# Altium schematic sheet IF.SchDoc
size Letter; DrawnBy: Titan Yuan; SheetNumber: 5; SheetTotal: 9
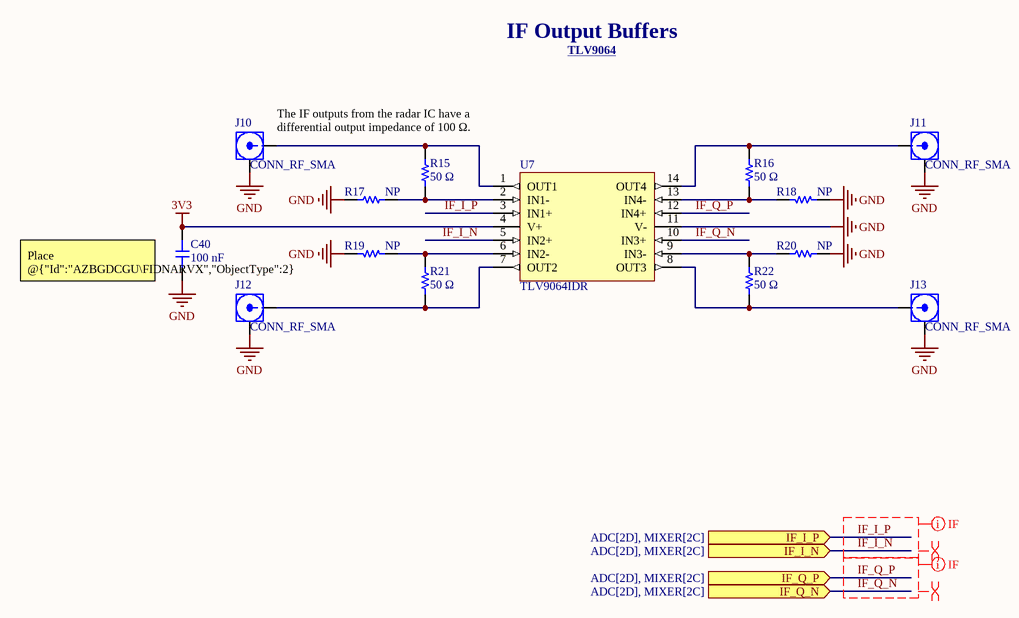
[diagram p0: IF.SchDoc]

## Parts
C40  100 nF  [CAP_0402]
J10  CONN_RF_SMA  [SMA-J-P-H-ST-TH1]
J11  CONN_RF_SMA  [SMA-J-P-H-ST-TH1]
J12  CONN_RF_SMA  [SMA-J-P-H-ST-TH1]
J13  CONN_RF_SMA  [SMA-J-P-H-ST-TH1]
R15  50 Ω  [RES_0603]
R16  50 Ω  [RES_0603]
R17  NP  [RES_0603]
R18  NP  [RES_0603]
R19  NP  [RES_0603]
R20  NP  [RES_0603]
R21  50 Ω  [RES_0603]
R22  50 Ω  [RES_0603]
U7  TLV9064IDR  [TLV9064IDR]

## Ports
IF_I_N (in, see ADC[2D], MIXER[2C]), IF_I_P (in, see ADC[2D], MIXER[2C]), IF_Q_N (in, see ADC[2D], MIXER[2C]), IF_Q_P (in, see ADC[2D], MIXER[2C])

## Nets
3V3: C40.2 U7.4(V+)
GND: C40.1 J10.2 J11.2 J12.2 J13.2 R17.2 R18.2 R19.2 R20.2 U7.11(V-)
IF_I_N: U7.5(IN2+) ; port IF_I_N
IF_I_P: U7.3(IN1+) ; port IF_I_P
IF_Q_N: U7.10(IN3+) ; port IF_Q_N
IF_Q_P: U7.12(IN4+) ; port IF_Q_P
NetJ10_1: J10.1 R15.2 U7.1(OUT1)
NetJ11_1: J11.1 R16.2 U7.14(OUT4)
NetJ12_1: J12.1 R21.2 U7.7(OUT2)
NetJ13_1: J13.1 R22.2 U7.8(OUT3)
NetR15_1: R15.1 R17.1 U7.2(IN1-)
NetR16_1: R16.1 R18.1 U7.13(IN4-)
NetR19_1: R19.1 R21.1 U7.6(IN2-)
NetR20_1: R20.1 R22.1 U7.9(IN3-)

## Layout directives
differential pair: IF_I_N, IF_I_P, IF_Q_N, IF_Q_P
mark named IF: IF_I_N, IF_I_P, IF_Q_N, IF_Q_P

## Notes on the sheet
- IF Output Buffers
- TLV9064 <https://www.ti.com/product/TLV9064>
- The IF outputs from the radar IC have a differential output impedance of 100 Ω.
- (near C40) Place @{"Id":"AZBGDCGU\FIDNARVX","ObjectType":2} as close to the device as possible.

## Library data of the parts
C40 = CAP: Ceramic Capacitor, Ceramic, 50V, 10% +Tol, 10% -Tol, X7R, 15% TC, 0.1uF, Surface Mount, 0402; Manufacturer: Yageo; Manufacturer Part Number: CC0402KPX7R9BB104; Tolerance: +-10%; Value: 100nF; Voltage Rating: 50 V; Dielectric: Ceramic; Package Size: 0402; Supplier: DigiKey; Supplier Part Number: 13-CC0402KPX7R9BB104CT-ND; RoHS: Compliant; Category: Ceramic Capacitors; Stock: 40680; Pricing: 1=0.1, 10=0.053, 50=0.0364, 100=0.0313, 500=0.02292, 1000=0.02035, 2500=0.01764, 5000=0.01601 (USD); Case/Package: 0402; China RoHS: Compliant; Dielectric Material: Ceramic; Height: 500µm; Lead Free: Lead Free; Length: 1mm; Lifecycle Status: Production; Max Operating Temperature: 125°C; Min Operating Temperature: -55°C; Mounting Technology: Surface Mount; Number of Terminals: 2; REACH SVHC: Yes; Voltage Rating (DC): 50V; Width: 500µm; ComponentLink1URL: https://datasheet.octopart.com:443/CC0402KPX7R9BB104-Yageo-datasheet-177165144.pdf?src-supplier=IHS; ComponentLink1Description: https://datasheet.octopart.com:443/CC0402KPX7R9BB104-Yageo-datasheet-177165144.pdf?src-supplier=IHS; ComponentLink2URL: https://datasheet.octopart.com:443/CC0402KPX7R9BB104-Yageo-Group-datasheet-189192896.pdf?src-supplier=Future+Electronics; ComponentLink2Description: https://datasheet.octopart.com:443/CC0402KPX7R9BB104-Yageo-Group-datasheet-189192896.pdf?src-supplier=Future+Electronics; ComponentLink3URL: https://datasheet.octopart.com:443/CC0402KPX7R9BB104-Yageo-datasheet-181967134.pdf?src-supplier=Farnell; ComponentLink3Description: https://datasheet.octopart.com:443/CC0402KPX7R9BB104-Yageo-datasheet-181967134.pdf?src-supplier=Farnell; ComponentLink4URL: https://datasheet.octopart.com/Surface-Mount-Ceramic-Multilayer-Capacitors%3B-General-Purpose-%26-High-Capacitance-Class-2%2C-X7R-Yageo-datasheet-family-114.pdf; ComponentLink4Description: https://datasheet.octopart.com/Surface-Mount-Ceramic-Multilayer-Capacitors%3B-General-Purpose-%26-High-Capacitance-Class-2%2C-X7R-Yageo-datasheet-family-114.pdf; ComponentLink5URL: https://datasheet.octopart.com/CC0402KPX7R9BB104-Yageo-datasheet-10883670.pdf; ComponentLink5Description: https://datasheet.octopart.com/CC0402KPX7R9BB104-Yageo-datasheet-10883670.pdf; ComponentLink6URL: http://sigma.octopart.com:80/rohs_statement/Surface-Mount-Ceramic-Multilayer-Capacitors%3B-General-Purpose-%26-High-Capacitance-Class-2%2C-X7R-Yageo-family-124.pdf?src-supplier=Compliance+Statements; ComponentLink6Description: http://sigma.octopart.com:80/rohs_statement/Surface-Mount-Ceramic-Multilayer-Capacitors%3B-General-Purpose-%26-High-Capacitance-Class-2%2C-X7R-Yageo-family-124.pdf?src-supplier=Compliance+Statements; ComponentLink7URL: http://sigma.octopart.com:80/reach_statement/Surface-Mount-Ceramic-Multilayer-Capacitors%3B-General-Purpose-%26-High-Capacitance-Class-2%2C-X7R-Yageo-family-125.pdf?src-supplier=Compliance+Statements; ComponentLink7Description: http://sigma.octopart.com:80/reach_statement/Surface-Mount-Ceramic-Multilayer-Capacitors%3B-General-Purpose-%26-High-Capacitance-Class-2%2C-X7R-Yageo-family-125.pdf?src-supplier=Compliance+Statements; ComponentLink8URL: http://sigma.octopart.com:80/conflict_mineral_statement/Yageo-company-3.pdf?src-supplier=Compliance+Statements; ComponentLink8Description: http://sigma.octopart.com:80/conflict_mineral_statement/Yageo-company-3.pdf?src-supplier=Compliance+Statements; ComponentLink9URL: http://sigma.octopart.com:80/rohs_statement/Yageo-company-2.pdf?src-supplier=Compliance+Statements; ComponentLink9Description: http://sigma.octopart.com:80/rohs_statement/Yageo-company-2.pdf?src-supplier=Compliance+Statements
J10-J13 = CONN_RF_SMA: RF / Coaxial Connector, SMA Coaxial, Straight Jack, Through Hole Vertical, 50 ohm; Manufacturer: Samtec; Manufacturer Lifecycle Status: PRODUCTION; Maximum Frequency: 20 GHz; Body Material: Brass; Body Plating: Gold; Connector Type: SMA, Socket; Dielectric Material: PTFE; Frequency: 20GHz; Gender: Female; Impedance: 50Ω; Clock Frequency: 6GHz; Number of Contacts: 1; Voltage Rating: 335V; Manufacturer Part Number: SMA-J-P-H-ST-TH1; Supplier: DigiKey; Supplier Part Number: SAM8971-ND; RoHS: Compliant; Category: RF / Coaxial Connectors; Stock: 25259; Pricing: 1=2.75, 10=2.333, 25=2.1864, 50=2.0818, 100=1.9823, 250=1.85816, 500=1.76948, 1000=1.68505, 2500=1.584 (USD); Case/Package: SMA; Contact Material: Gold; Contact Plating: Gold; Depth: 7mm; Fastening Type: Threaded; Height: 9.81mm; Housing Color: Gold; Insulation Material: Polytetrafluoroethylene; Length: 7mm; Lifecycle Status: Production; Max Operating Temperature: 125°C; Min Operating Temperature: -65°C; Mounting Technology: Flanges, Panel, Through Hole; Orientation: Straight; Radiation Hardening: No; Termination: Solder; ComponentLink1URL: https://datasheet.octopart.com:443/SMA-J-P-H-ST-TH1-Samtec-datasheet-104427088.pdf?src-supplier=Upverter; ComponentLink1Description: https://datasheet.octopart.com:443/SMA-J-P-H-ST-TH1-Samtec-datasheet-104427088.pdf?src-supplier=Upverter; ComponentLink2URL: https://sigma.octopart.com:443/97281565/technical_drawing/Samtec-SMA-J-P-H-ST-TH1.pdf?src-supplier=Upverter; ComponentLink2Description: https://sigma.octopart.com:443/97281565/technical_drawing/Samtec-SMA-J-P-H-ST-TH1.pdf?src-supplier=Upverter; ComponentLink3URL: https://datasheet.octopart.com:443/SMA-J-P-H-ST-TH1-Samtec-datasheet-97281556.pdf?src-supplier=Electro+Sonic; ComponentLink3Description: https://datasheet.octopart.com:443/SMA-J-P-H-ST-TH1-Samtec-datasheet-97281556.pdf?src-supplier=Electro+Sonic; ComponentLink4URL: https://datasheet.octopart.com:443/SMA-J-P-H-ST-TH1-Samtec-datasheet-157420883.pdf?src-supplier=Newark; ComponentLink4Description: https://datasheet.octopart.com:443/SMA-J-P-H-ST-TH1-Samtec-datasheet-157420883.pdf?src-supplier=Newark; ComponentLink5URL: https://datasheet.octopart.com:443/SMA-J-P-H-ST-TH1-Samtec-datasheet-180264035.pdf?src-supplier=JRH+Electronics; ComponentLink5Description: https://datasheet.octopart.com:443/SMA-J-P-H-ST-TH1-Samtec-datasheet-180264035.pdf?src-supplier=JRH+Electronics; ComponentLink6URL: https://datasheet.octopart.com:443/SMA-J-P-H-ST-TH1-Samtec-datasheet-159753816.pdf?src-supplier=Toby+Electronics; ComponentLink6Description: https://datasheet.octopart.com:443/SMA-J-P-H-ST-TH1-Samtec-datasheet-159753816.pdf?src-supplier=Toby+Electronics; ComponentLink7URL: https://datasheet.octopart.com:443/SMA-J-P-H-ST-TH1-Samtec-datasheet-116536392.pdf?src-supplier=Toby+Electronics; ComponentLink7Description: https://datasheet.octopart.com:443/SMA-J-P-H-ST-TH1-Samtec-datasheet-116536392.pdf?src-supplier=Toby+Electronics; ComponentLink8URL: https://datasheet.octopart.com:443/SMA-J-P-H-ST-TH1-Samtec-datasheet-116536236.pdf?src-supplier=Toby+Electronics; ComponentLink8Description: https://datasheet.octopart.com:443/SMA-J-P-H-ST-TH1-Samtec-datasheet-116536236.pdf?src-supplier=Toby+Electronics
R15 R16 R21 R22 = RES: 100mW Thin Film Resistor ±50ppm/℃ ±0.1% 50Ω 0603 Chip Resistor - Surface Mount ROHS; Manufacturer: Yageo; Manufacturer Part Number: RT0603BRE0750RL; Power Rating: 1/10 W; Temperature Coefficient: 50ppm/°C; Working Voltage: 75V; Tolerance: 0.1%; Package Size: 0603; Supplier: DigiKey; Supplier Part Number: 13-RT0603BRE0750RLCT-ND; RoHS: Compliant; Category: Chip SMD Resistors; Stock: 31948; Pricing: 1=0.1, 10=0.085, 50=0.0746, 100=0.0704, 500=0.06184 (USD); Case/Package: 0603; China RoHS: Non-Compliant; Composition: Thin Film; Country of Origin: Mainland China, Taiwan; Export Control Classification Number (ECCN) Code: EAR99; Features: Moisture Resistant; Height: 558.8µm; Harmonized Tariff Schedule (HTS) Code: 8533.21.00.30; Introduction Date: 2017-09-12; Length: 1.6002mm; Lifecycle Status: Production; Max Operating Temperature: 155°C; Max Power Dissipation: 100mW; Min Operating Temperature: -55°C; Mounting Technology: Surface Mount; Number of Terminals: 2; Number of Terminations: 2; Packaging: Tape & Reel; REACH SVHC: Yes; Value: 50Ω; Width: 787.4µm; ComponentLink1URL: https://datasheet.octopart.com:443/RT0603BRE0750RL-Yageo-datasheet-96443642.pdf?src-supplier=IHS; ComponentLink1Description: https://datasheet.octopart.com:443/RT0603BRE0750RL-Yageo-datasheet-96443642.pdf?src-supplier=IHS; ComponentLink2URL: https://datasheet.octopart.com:443/RT0603BRE0750RL-Yageo-datasheet-176402239.pdf?src-supplier=Future+Electronics; ComponentLink2Description: https://datasheet.octopart.com:443/RT0603BRE0750RL-Yageo-datasheet-176402239.pdf?src-supplier=Future+Electronics; ComponentLink3URL: https://datasheet.octopart.com:443/RT0603BRE0750RL-Yageo-datasheet-169971040.pdf?src-supplier=Future+Electronics; ComponentLink3Description: https://datasheet.octopart.com:443/RT0603BRE0750RL-Yageo-datasheet-169971040.pdf?src-supplier=Future+Electronics; ComponentLink4URL: https://datasheet.octopart.com:443/RT0603BRE0750RL-Yageo-datasheet-166250672.pdf?src-supplier=Future+Electronics; ComponentLink4Description: https://datasheet.octopart.com:443/RT0603BRE0750RL-Yageo-datasheet-166250672.pdf?src-supplier=Future+Electronics; ComponentLink5URL: https://datasheet.octopart.com:443/RT0603BRE0750RL-Yageo-datasheet-137700930.pdf?src-supplier=Future+Electronics; ComponentLink5Description: https://datasheet.octopart.com:443/RT0603BRE0750RL-Yageo-datasheet-137700930.pdf?src-supplier=Future+Electronics; ComponentLink6URL: https://datasheet.octopart.com:443/RT0603BRE0750RL-Yageo-Group-datasheet-141265893.pdf?src-supplier=ODG+(Origin+Data+Global); ComponentLink6Description: https://datasheet.octopart.com:443/RT0603BRE0750RL-Yageo-Group-datasheet-141265893.pdf?src-supplier=ODG+(Origin+Data+Global); ComponentLink7URL: https://datasheet.octopart.com/RT0603BRE0750RL-Yageo-datasheet-86813807.pdf; ComponentLink7Description: https://datasheet.octopart.com/RT0603BRE0750RL-Yageo-datasheet-86813807.pdf; ComponentLink8URL: http://sigma.octopart.com:80/conflict_mineral_statement/Yageo-company-3.pdf?src-supplier=Compliance+Statements; ComponentLink8Description: http://sigma.octopart.com:80/conflict_mineral_statement/Yageo-company-3.pdf?src-supplier=Compliance+Statements; ComponentLink9URL: http://sigma.octopart.com:80/rohs_statement/Yageo-company-2.pdf?src-supplier=Compliance+Statements; ComponentLink9Description: http://sigma.octopart.com:80/rohs_statement/Yageo-company-2.pdf?src-supplier=Compliance+Statements
R17-R20 = RES: Resistor SMD Generic; Manufacturer: *; Manufacturer Part Number: *; Tolerance: *; Package Size: 0603; Voltage Rating: *
U7 = TLV9064IDR: Quad, 5.5-V, 10-MHz, RRIO operational amplifier for cost-optimized applications 14-SOIC -40 to 125; Manufacturer: Texas Instruments; Manufacturer Lifecycle Status: ACTIVE; Bandwidth: 10MHz; Number of Channels: 4; Slew Rate: 6.5V/µs; Manufacturer Part Number: TLV9064IDR; Supplier: DigiKey; Supplier Part Number: 296-47549-1-ND; RoHS: Compliant; Category: Amplifiers - Op Amps, Buffer, Instrumentation; Stock: 4493; Pricing: 1=1.49, 10=1.085, 25=0.9844, 100=0.8739, 250=0.8212, 500=0.78944, 1000=0.76329 (USD); Case/Package: SOIC; Height: 0m; Length: 8.65mm; Lifecycle Status: Production; Max Operating Temperature: 125°C; Min Operating Temperature: -40°C; Pins: 14; Packaging: Cut Tape; Schedule B: 8542330000, 8542330000|8542330000|8542330000|8542330000|8542330000; Thickness: 1.58mm; Width: 3.91mm; ComponentLink1URL: https://sigma.octopart.com:443/182471030/technical_drawing/Texas-Instruments-TLV9064IDR.pdf?src-supplier=Texas+Instruments; ComponentLink1Description: https://sigma.octopart.com:443/182471030/technical_drawing/Texas-Instruments-TLV9064IDR.pdf?src-supplier=Texas+Instruments; ComponentLink2URL: https://octopart.com:443/opatz8j6/c1?t=b8RlzpfQG-h9uOWAabMAiPJWoCTgAwquZzec_BkdV6ZjMU2OI4YyppNX09BT2fM0gpcDMTQrYtgvce6_TtfmK4XZa-h4SQxM8TKEKMrJJktc7O_kAaPT_h62tC27hsW5hQAKMoGbKBjHibz2blvr-fhN1RVl1yW8EvD465A9BJDSrY_kRU3crDNophsG2nTX2Be3i9H2X4Kl0o-rARNMZYxgtWRCQAP9XVS_fu0jqO5PbtSNR57rXOk02X4GKKjnzDeVifR_OIS0uZ1j_pAkmvXspyYvhGUJvwUxZqgyekwRIScv7vrk5hgDM9rgOsgWHAf34DWgZgApfn4NaTTf5ebtlEHCtjJg6ABKjJ4CBoMZf9D-5muRZyk3ZTspSwA1lzBPrFk&src-supplier=Texas+Instruments; ComponentLink2Description: https://octopart.com:443/opatz8j6/c1?t=b8RlzpfQG-h9uOWAabMAiPJWoCTgAwquZzec_BkdV6ZjMU2OI4YyppNX09BT2fM0gpcDMTQrYtgvce6_TtfmK4XZa-h4SQxM8TKEKMrJJktc7O_kAaPT_h62tC27hsW5hQAKMoGbKBjHibz2blvr-fhN1RVl1yW8EvD465A9BJDSrY_kRU3crDNophsG2nTX2Be3i9H2X4Kl0o-rARNMZYxgtWRCQAP9XVS_fu0jqO5PbtSNR57rXOk02X4GKKjnzDeVifR_OIS0uZ1j_pAkmvXspyYvhGUJvwUxZqgyekwRIScv7vrk5hgDM9rgOsgWHAf34DWgZgApfn4NaTTf5ebtlEHCtjJg6ABKjJ4CBoMZf9D-5muRZyk3ZTspSwA1lzBPrFk&src-supplier=Texas+Instruments; ComponentLink3URL: https://sigma.octopart.com:443/49249646/technical_drawing/Texas-Instruments-TLV9064IDR.pdf?src-supplier=Texas+Instruments; ComponentLink3Description: https://sigma.octopart.com:443/49249646/technical_drawing/Texas-Instruments-TLV9064IDR.pdf?src-supplier=Texas+Instruments; ComponentLink4URL: https://datasheet.octopart.com:443/TLV9064IDR-Texas-Instruments-datasheet-101609303.pdf?src-supplier=Farnell; ComponentLink4Description: https://datasheet.octopart.com:443/TLV9064IDR-Texas-Instruments-datasheet-101609303.pdf?src-supplier=Farnell; ComponentLink5URL: https://datasheet.octopart.com:443/TLV9064IDR-Texas-Instruments-datasheet-160738807.pdf?src-supplier=LCSC; ComponentLink5Description: https://datasheet.octopart.com:443/TLV9064IDR-Texas-Instruments-datasheet-160738807.pdf?src-supplier=LCSC; ComponentLink6URL: https://datasheet.octopart.com:443/TLV9064IDR-Texas-Instruments-datasheet-159117845.pdf?src-supplier=LCSC; ComponentLink6Description: https://datasheet.octopart.com:443/TLV9064IDR-Texas-Instruments-datasheet-159117845.pdf?src-supplier=LCSC; ComponentLink7URL: http://sigma.octopart.com:80/reach_statement/Texas-Instruments-company-64.pdf?src-supplier=Compliance+Statements; ComponentLink7Description: http://sigma.octopart.com:80/reach_statement/Texas-Instruments-company-64.pdf?src-supplier=Compliance+Statements; ComponentLink8URL: http://sigma.octopart.com:80/conflict_mineral_statement/Texas-Instruments-company-63.pdf?src-supplier=Compliance+Statements; ComponentLink8Description: http://sigma.octopart.com:80/conflict_mineral_statement/Texas-Instruments-company-63.pdf?src-supplier=Compliance+Statements